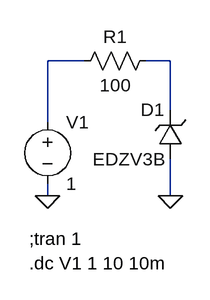
[diagram p0: schematic ZenerTest.asc]
ZenerTest.asc, the LTspice schematic file:
Version 4
SHEET 1 880 680
WIRE 192 64 144 64
WIRE 304 64 272 64
WIRE 304 128 304 64
WIRE 144 144 144 64
WIRE 144 240 144 224
WIRE 304 240 304 192
FLAG 144 240 0
FLAG 304 240 0
SYMBOL voltage 144 128 R0
WINDOW 123 0 0 Left 2
WINDOW 39 0 0 Left 2
SYMATTR InstName V1
SYMATTR Value 1
SYMBOL res 288 48 R90
WINDOW 0 0 56 VBottom 2
WINDOW 3 32 56 VTop 2
SYMATTR InstName R1
SYMATTR Value 100
SYMBOL zener 320 192 R180
WINDOW 0 24 64 Left 2
WINDOW 3 24 0 Left 2
SYMATTR InstName D1
SYMATTR Value EDZV3B
TEXT 120 296 Left 2 !;tran 1
TEXT 120 328 Left 2 !.dc V1 1 10 10m

The netlist it stands for:
* ZenerTest.asc
V1 N001 0 1
R1 N002 N001 100
D1 0 N002 EDZV3B
.model D D
.lib standard.dio
;tran 1
.dc V1 1 10 10m
.backanno
.end